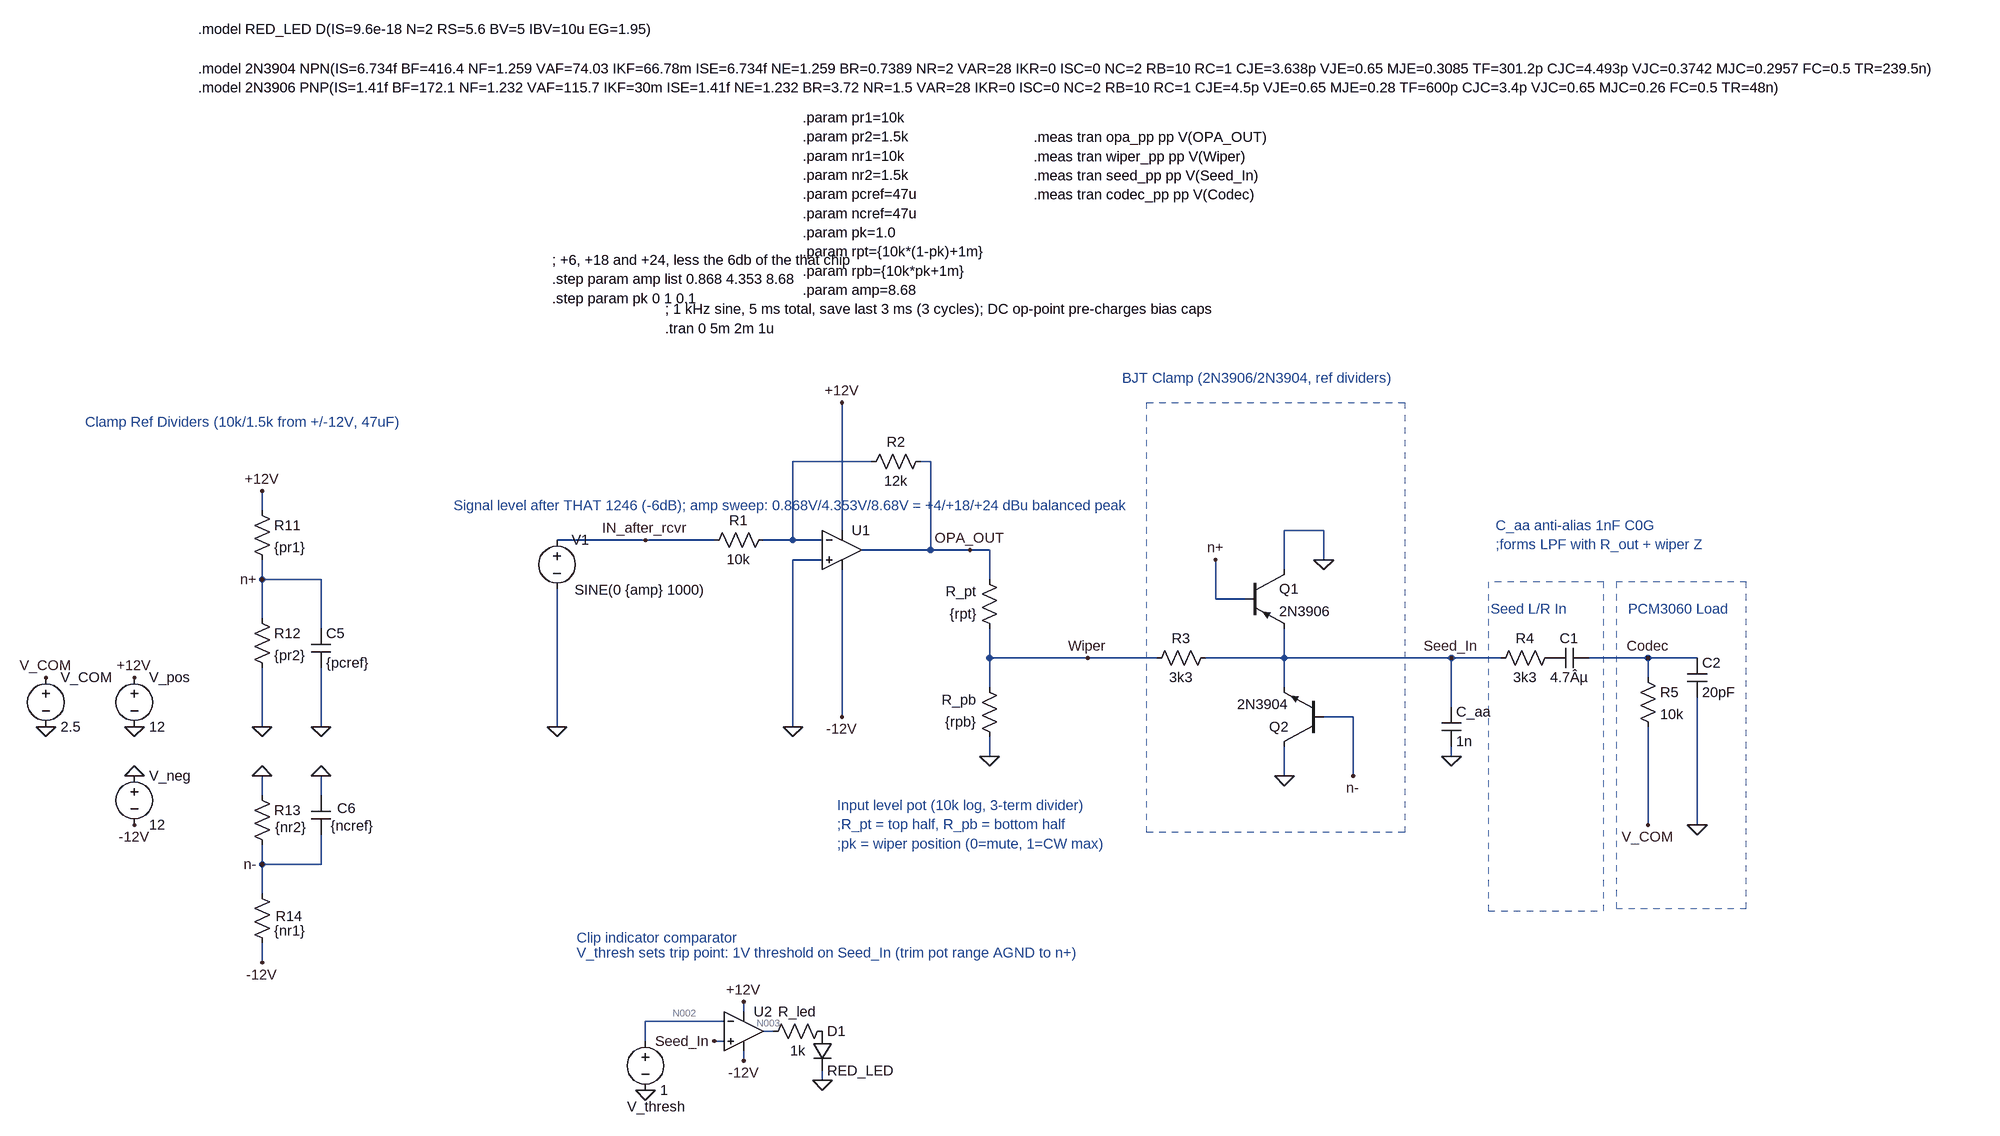
[diagram p0: schematic measure.asc]
measure.asc, the LTspice schematic file:
Version 4
SHEET 1 3124 2460
WIRE 608 576 480 576
WIRE 704 576 688 576
WIRE -384 656 -384 624
WIRE 560 688 560 480
WIRE 1344 688 1280 688
WIRE 240 704 96 704
WIRE 352 704 240 704
WIRE 480 704 480 576
WIRE 480 704 432 704
WIRE 528 704 480 704
WIRE 704 720 704 576
WIRE 704 720 592 720
WIRE 768 720 704 720
WIRE 800 720 768 720
WIRE 528 736 480 736
WIRE 1344 736 1344 688
WIRE 1280 752 1280 688
WIRE -384 768 -384 736
WIRE -288 768 -384 768
WIRE 800 768 800 720
WIRE 1168 800 1168 736
WIRE 1216 800 1168 800
WIRE -384 832 -384 768
WIRE -288 848 -288 768
WIRE 800 896 800 848
WIRE 960 896 800 896
WIRE 1072 896 960 896
WIRE 1280 896 1280 848
WIRE 1280 896 1152 896
WIRE 1552 896 1280 896
WIRE 1632 896 1552 896
WIRE 1872 896 1776 896
WIRE 1952 896 1872 896
WIRE 1872 928 1872 896
WIRE 800 944 800 896
WIRE 1280 944 1280 896
WIRE 1552 976 1552 896
WIRE 560 992 560 752
WIRE 1392 992 1344 992
WIRE -384 1008 -384 912
WIRE -288 1008 -288 912
WIRE 96 1008 96 784
WIRE 480 1008 480 736
WIRE 800 1056 800 1024
WIRE 1552 1056 1552 1040
WIRE 1280 1088 1280 1040
WIRE 1392 1088 1392 992
WIRE -384 1120 -384 1088
WIRE -288 1120 -288 1088
WIRE 1872 1168 1872 1008
WIRE 1952 1168 1952 960
WIRE -384 1232 -384 1200
WIRE -288 1232 -288 1184
WIRE -288 1232 -384 1232
WIRE -384 1280 -384 1232
WIRE -384 1392 -384 1360
WIRE 400 1472 400 1456
WIRE 368 1488 240 1488
WIRE 448 1504 432 1504
WIRE 240 1520 240 1488
WIRE 368 1520 352 1520
WIRE 400 1552 400 1536
WIRE 528 1584 528 1568
FLAG -592 928 +12V
FLAG -592 1008 0
FLAG -592 1088 0
FLAG -592 1168 -12V
FLAG -384 624 +12V
FLAG -384 768 n+
FLAG -384 1008 0
FLAG -288 1008 0
FLAG -384 1088 0
FLAG -384 1232 n-
FLAG -384 1392 -12V
FLAG -288 1088 0
FLAG -736 928 V_COM
FLAG -736 1008 0
FLAG 96 1008 0
FLAG 240 704 IN_after_rcvr
FLAG 480 1008 0
FLAG 560 480 +12V
FLAG 560 992 -12V
FLAG 1552 896 Seed_In
FLAG 1872 896 Codec
FLAG 1872 1168 V_COM
FLAG 1952 1168 0
FLAG 1168 736 n+
FLAG 1344 736 0
FLAG 1392 1088 n-
FLAG 1280 1088 0
FLAG 352 1520 Seed_In
FLAG 240 1600 0
FLAG 400 1456 +12V
FLAG 400 1552 -12V
FLAG 528 1584 0
FLAG 960 896 Wiper
FLAG 1552 1056 0
FLAG 800 1056 0
FLAG 768 720 OPA_OUT
SYMBOL voltage -592 912 R0
SYMATTR InstName V_pos
SYMATTR Value 12
SYMBOL voltage -592 1072 R0
SYMATTR InstName V_neg
SYMATTR Value 12
SYMBOL res -400 640 R0
SYMATTR InstName R11
SYMATTR Value {pr1}
SYMBOL res -400 816 R0
SYMATTR InstName R12
SYMATTR Value {pr2}
SYMBOL cap -304 848 R0
SYMATTR InstName C5
SYMATTR Value {pcref}
SYMBOL res -400 1104 R0
WINDOW 3 37 68 Left 2
SYMATTR Value {nr2}
SYMATTR InstName R13
SYMBOL res -400 1264 R0
WINDOW 0 38 53 Left 2
SYMATTR InstName R14
SYMATTR Value {nr1}
SYMBOL cap -304 1120 R0
WINDOW 0 42 21 Left 2
WINDOW 3 32 49 Left 2
SYMATTR InstName C6
SYMATTR Value {ncref}
SYMBOL voltage -736 912 R0
SYMATTR InstName V_COM
SYMATTR Value 2.5
SYMBOL voltage 96 688 R0
WINDOW 3 29 97 Left 2
SYMATTR Value SINE(0 {amp} 1000)
SYMATTR InstName V1
SYMATTR Value2 AC 1
SYMBOL res 336 720 R270
WINDOW 0 32 56 VTop 2
WINDOW 3 0 56 VBottom 2
SYMATTR InstName R1
SYMATTR Value 10k
SYMBOL OpAmps/UniversalOpAmp2 560 720 R0
SYMATTR InstName U1
SYMATTR Value2 Avol=1Meg GBW=53Meg Slew=24Meg Vhigh=11 Vlow=-11
SYMBOL res 592 592 R270
WINDOW 0 32 56 VTop 2
WINDOW 3 0 56 VBottom 2
SYMATTR InstName R2
SYMATTR Value 12k
SYMBOL res 1056 912 R270
WINDOW 0 32 56 VTop 2
WINDOW 3 0 56 VBottom 2
SYMATTR InstName R3
SYMATTR Value 3k3
SYMBOL pnp 1216 752 R0
SYMATTR InstName Q1
SYMATTR Value 2N3906
SYMBOL npn 1344 1040 R180
SYMATTR InstName Q2
SYMATTR Value 2N3904
SYMBOL res 1616 912 R270
WINDOW 0 32 56 VTop 2
WINDOW 3 0 56 VBottom 2
SYMATTR InstName R4
SYMATTR Value 3k3
SYMBOL cap 1776 880 R90
WINDOW 0 0 32 VBottom 2
WINDOW 3 32 32 VTop 2
SYMATTR InstName C1
SYMATTR Value 4.7Âµ
SYMBOL res 1856 912 R0
SYMATTR InstName R5
SYMATTR Value 10k
SYMBOL cap 1936 896 R0
SYMATTR InstName C2
SYMATTR Value 20pF
SYMBOL OpAmps/UniversalOpAmp2 400 1504 R0
SYMATTR InstName U2
SYMBOL voltage 240 1504 R0
WINDOW 0 -30 123 Left 2
SYMATTR InstName V_thresh
SYMATTR Value 1
SYMBOL res 432 1520 R270
WINDOW 0 32 56 VTop 2
WINDOW 3 0 56 VBottom 2
SYMATTR InstName R_led
SYMATTR Value 1k
SYMBOL diode 512 1504 R0
SYMATTR InstName D1
SYMATTR Value RED_LED
SYMBOL cap 1536 976 R0
SYMATTR InstName C_aa
SYMATTR Value 1n
SYMBOL Res 816 864 R180
WINDOW 0 36 76 Left 2
WINDOW 3 36 40 Left 2
SYMATTR InstName R_pt
SYMATTR Value {rpt}
SYMBOL Res 816 1040 R180
WINDOW 0 36 76 Left 2
WINDOW 3 36 40 Left 2
SYMATTR InstName R_pb
SYMATTR Value {rpb}
TEXT 272 328 Left 2 !; 1 kHz sine, 5 ms total, save last 3 ms (3 cycles); DC op-point pre-charges bias caps\n.tran 0 5m 2m 1u
TEXT -488 -64 Left 2 !.model 2N3904 NPN(IS=6.734f BF=416.4 NF=1.259 VAF=74.03 IKF=66.78m ISE=6.734f NE=1.259 BR=0.7389 NR=2 VAR=28 IKR=0 ISC=0 NC=2 RB=10 RC=1 CJE=3.638p VJE=0.65 MJE=0.3085 TF=301.2p CJC=4.493p VJC=0.3742 MJC=0.2957 FC=0.5 TR=239.5n)\n.model 2N3906 PNP(IS=1.41f BF=172.1 NF=1.232 VAF=115.7 IKF=30m ISE=1.41f NE=1.232 BR=3.72 NR=1.5 VAR=28 IKR=0 ISC=0 NC=2 RB=10 RC=1 CJE=4.5p VJE=0.65 MJE=0.28 TF=600p CJC=3.4p VJC=0.65 MJC=0.26 FC=0.5 TR=48n)
TEXT -488 -128 Left 2 !.model RED_LED D(IS=9.6e-18 N=2 RS=5.6 BV=5 IBV=10u EG=1.95)
TEXT -72 648 Left 2 ;Signal level after THAT 1246 (-6dB); amp sweep: 0.868V/4.353V/8.68V = +4/+18/+24 dBu balanced peak
TEXT 1016 440 Left 2 ;BJT Clamp (2N3906/2N3904, ref dividers)
TEXT 1616 816 Left 2 ;Seed L/R In
TEXT 1840 816 Left 2 ;PCM3060 Load
TEXT -672 512 Left 2 ;Clamp Ref Dividers (10k/1.5k from +/-12V, 47uF)
TEXT 496 16 Left 2 !.param pr1=10k\n.param pr2=1.5k\n.param nr1=10k\n.param nr2=1.5k\n.param pcref=47u\n.param ncref=47u\n.param pk=1.0\n.param rpt={10k*(1-pk)+1m}\n.param rpb={10k*pk+1m}\n.param amp=8.68
TEXT 872 48 Left 2 !.meas tran opa_pp pp V(OPA_OUT)\n.meas tran wiper_pp pp V(Wiper)\n.meas tran seed_pp pp V(Seed_In)\n.meas tran codec_pp pp V(Codec)
TEXT 128 1352 Left 2 ;Clip indicator comparator
TEXT 128 1376 Left 2 ;V_thresh sets trip point: 1V threshold on Seed_In (trim pot range AGND to n+)
TEXT 552 1136 Left 2 ;Input level pot (10k log, 3-term divider)\n;R_pt = top half, R_pb = bottom half\n;pk = wiper position (0=mute, 1=CW max)
TEXT 1624 680 Left 2 ;C_aa anti-alias 1nF C0G\n;forms LPF with R_out + wiper Z
TEXT 88 248 Left 2 !; +6, +18 and +24, less the 6db of the that chip\n.step param amp list 0.868 4.353 8.68\n.step param pk 0 1 0.1
RECTANGLE Normal 1820 1304 2032 772 2
RECTANGLE Normal 1612 1308 1800 772 2
RECTANGLE Normal 1476 1180 1056 480 2

The netlist it stands for:
* measure.asc
V_pos +12V 0 12
V_neg 0 -12V 12
R11 +12V n+ {pr1}
R12 n+ 0 {pr2}
C5 n+ 0 {pcref}
R13 0 n- {nr2}
R14 n- -12V {nr1}
C6 0 n- {ncref}
V_COM V_COM 0 2.5
V1 IN_after_rcvr 0 SINE(0 {amp} 1000) AC 1
R1 IN_after_rcvr N001 10k
XU1 0 N001 +12V -12V OPA_OUT level2 Avol=1Meg GBW=53Meg Slew=24Meg Vhigh=11 Vlow=-11 Ilimit=25m Rail=0 Vos=0 En=0 Enk=0 In=0 Ink=0 Rin=500Meg  ; pins In+ In- V+ V- OUT
R2 N001 OPA_OUT 12k
R3 Wiper Seed_In 3k3
Q1 0 n+ Seed_In 0 2N3906
Q2 0 n- Seed_In 0 2N3904
R4 Seed_In P001 3k3
C1 Codec P001 4.7Âµ
R5 Codec V_COM 10k
C2 Codec 0 20pF
XU2 Seed_In N002 +12V -12V N003 level2 Avol=1Meg GBW=10Meg Slew=10Meg Ilimit=25m Rail=0 Vos=0 En=0 Enk=0 In=0 Ink=0 Rin=500Meg  ; pins In+ In- V+ V- OUT
V_thresh N002 0 1
R_led N003 P002 1k
D1 P002 0 RED_LED
C_aa Seed_In 0 1n
R_pt Wiper OPA_OUT {rpt}
R_pb 0 Wiper {rpb}
.model D D
.lib standard.dio
.model NPN NPN
.model PNP PNP
.lib standard.bjt
; 1 kHz sine, 5 ms total, save last 3 ms (3 cycles); DC op-point pre-charges bias caps
.tran 0 5m 2m 1u
.model 2N3904 NPN(IS=6.734f BF=416.4 NF=1.259 VAF=74.03 IKF=66.78m ISE=6.734f NE=1.259 BR=0.7389 NR=2 VAR=28 IKR=0 ISC=0 NC=2 RB=10 RC=1 CJE=3.638p VJE=0.65 MJE=0.3085 TF=301.2p CJC=4.493p VJC=0.3742 MJC=0.2957 FC=0.5 TR=239.5n)
.model 2N3906 PNP(IS=1.41f BF=172.1 NF=1.232 VAF=115.7 IKF=30m ISE=1.41f NE=1.232 BR=3.72 NR=1.5 VAR=28 IKR=0 ISC=0 NC=2 RB=10 RC=1 CJE=4.5p VJE=0.65 MJE=0.28 TF=600p CJC=3.4p VJC=0.65 MJC=0.26 FC=0.5 TR=48n)
.model RED_LED D(IS=9.6e-18 N=2 RS=5.6 BV=5 IBV=10u EG=1.95)
* Signal level after THAT 1246 (-6dB); amp sweep: 0.868V/4.353V/8.68V = +4/+18/+24 dBu balanced peak
* BJT Clamp (2N3906/2N3904, ref dividers)
* Seed L/R In
* PCM3060 Load
* Clamp Ref Dividers (10k/1.5k from +/-12V, 47uF)
.param pr1=10k
.param pr2=1.5k
.param nr1=10k
.param nr2=1.5k
.param pcref=47u
.param ncref=47u
.param pk=1.0
.param rpt={10k*(1-pk)+1m}
.param rpb={10k*pk+1m}
.param amp=8.68
.meas tran opa_pp pp V(OPA_OUT)
.meas tran wiper_pp pp V(Wiper)
.meas tran seed_pp pp V(Seed_In)
.meas tran codec_pp pp V(Codec)
* Clip indicator comparator
* V_thresh sets trip point: 1V threshold on Seed_In (trim pot range AGND to n+)
* Input level pot (10k log, 3-term divider)
* ;R_pt = top half, R_pb = bottom half
* ;pk = wiper position (0=mute, 1=CW max)
* C_aa anti-alias 1nF C0G
* ;forms LPF with R_out + wiper Z
; +6, +18 and +24, less the 6db of the that chip
.step param amp list 0.868 4.353 8.68
.step param pk 0 1 0.1
.lib UniversalOpAmp2.lib
.backanno
.end

* Results of the author's LTspice run, read from the files saved beside the schematic
* Operating Point (first step), zero values left out:
*   amp = 868 m
*   V(+12v) = 12 V
*   V(-12v) = -12 V
*   V(n+) = 1.565 V
*   V(n-) = -1.565 V
*   V(v_com) = 2.5 V
*   V(seed_in) = 38.76 nV
*   V(p001) = 77.53 nV
*   V(codec) = 2.5 V
*   V(n003) = -11.93 V
*   V(n002) = 1 V
*   V(p002) = -5.206 V
*   Ic(Q1) = -1.566 pA
*   Ib(Q1) = 3.132 pA
*   Ie(Q1) = -1.567 pA
*   Ic(Q2) = 1.574 pA
*   Ib(Q2) = -3.146 pA
*   Ie(Q2) = 1.572 pA
*   I(C1) = 11.75 pA
*   I(D1) = -6.723 mA
*   I(R11) = 1.043 mA
*   I(R12) = 1.043 mA
*   I(R13) = 1.043 mA
*   I(R14) = 1.043 mA
*   I(R3) = -11.74 pA
*   I(R4) = -11.75 pA
*   I(R5) = -11.75 pA
*   I(R_led) = -6.723 mA
*   I(R_pb) = -11.74 pA
*   I(V_pos) = -2.245 mA
*   I(V_neg) = -8.968 mA
*   I(V_com) = -11.75 pA
*   I(V_thresh) = -2 nA
*   Ix(u1:3) = 1.199 mA
*   Ix(u1:4) = -1.199 mA
*   Ix(u2:2) = 2 nA
*   Ix(u2:3) = 2.684 µA
*   Ix(u2:4) = -6.725 mA
*   Ix(u2:5) = 6.723 mA
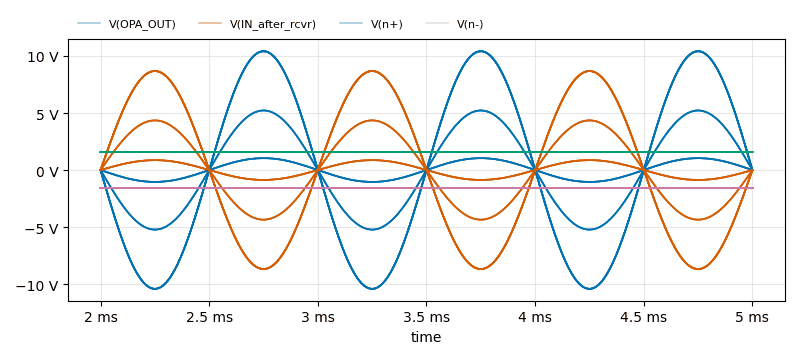
[diagram p1: Transient Analysis of measure.asc, plotted from the saved traces]
* Transient Analysis, 33 runs:
*   V(OPA_OUT) [run 1]: min -1.042 V, max 1.042 V, average 1.317 µV, rms 736.5 mV, last 43.39 µV
*   V(OPA_OUT) [run 2]: min -10.42 V, max 10.42 V, average 0 V, rms 7.365 V, last 433.9 µV
*   V(OPA_OUT) [run 3]: min -5.224 V, max 5.224 V, average -32.15 µV, rms 3.694 V, last 217.6 µV
*   V(OPA_OUT) [run 4]: min -1.042 V, max 1.042 V, average 7.227 µV, rms 736.6 mV, last 43.39 µV
*   V(OPA_OUT) [run 5]: min -10.42 V, max 10.42 V, average 572.9 µV, rms 7.37 V, last 433.9 µV
*   V(OPA_OUT) [run 6]: min -5.224 V, max 5.223 V, average 608.2 µV, rms 3.694 V, last 217.6 µV
*   V(OPA_OUT) [run 7]: min -1.042 V, max 1.042 V, average 34.13 µV, rms 736.6 mV, last 43.4 µV
*   V(OPA_OUT) [run 8]: min -10.42 V, max 10.42 V, average 229.1 µV, rms 7.37 V, last 434 µV
*   V(IN_after_rcvr) [run 1]: min -868 mV, max 868 mV, average -949.9 nV, rms 613.8 mV, last 0 V
*   V(IN_after_rcvr) [run 2]: min -8.68 V, max 8.68 V, average -4.273 µV, rms 6.138 V, last 0 V
*   V(IN_after_rcvr) [run 3]: min -4.353 V, max 4.353 V, average 26.79 µV, rms 3.079 V, last 0 V
*   V(IN_after_rcvr) [run 4]: min -868 mV, max 868 mV, average -6.025 µV, rms 613.9 mV, last 0 V
*   V(IN_after_rcvr) [run 5]: min -8.68 V, max 8.68 V, average -476.8 µV, rms 6.141 V, last 0 V
*   V(IN_after_rcvr) [run 6]: min -4.353 V, max 4.353 V, average -506.4 µV, rms 3.078 V, last 0 V
*   V(IN_after_rcvr) [run 7]: min -868 mV, max 868 mV, average -28.44 µV, rms 613.9 mV, last 0 V
*   V(IN_after_rcvr) [run 8]: min -8.68 V, max 8.679 V, average -190.6 µV, rms 6.142 V, last 0 V
*   V(n+) [run 1]: min 1.565 V, max 1.565 V, average 1.565 V, rms 1.565 V, last 1.565 V
*   V(n+) [run 2]: min 1.565 V, max 1.565 V, average 1.565 V, rms 1.565 V, last 1.565 V
*   V(n+) [run 3]: min 1.565 V, max 1.565 V, average 1.565 V, rms 1.565 V, last 1.565 V
*   V(n+) [run 4]: min 1.565 V, max 1.565 V, average 1.565 V, rms 1.565 V, last 1.565 V
*   V(n+) [run 5]: min 1.565 V, max 1.565 V, average 1.565 V, rms 1.565 V, last 1.565 V
*   V(n+) [run 6]: min 1.565 V, max 1.565 V, average 1.565 V, rms 1.565 V, last 1.565 V
*   V(n+) [run 7]: min 1.565 V, max 1.565 V, average 1.565 V, rms 1.565 V, last 1.565 V
*   V(n+) [run 8]: min 1.566 V, max 1.566 V, average 1.566 V, rms 1.566 V, last 1.566 V
*   V(n-) [run 1]: min -1.565 V, max -1.565 V, average -1.565 V, rms 1.565 V, last -1.565 V
*   V(n-) [run 2]: min -1.565 V, max -1.565 V, average -1.565 V, rms 1.565 V, last -1.565 V
*   V(n-) [run 3]: min -1.565 V, max -1.565 V, average -1.565 V, rms 1.565 V, last -1.565 V
*   V(n-) [run 4]: min -1.565 V, max -1.565 V, average -1.565 V, rms 1.565 V, last -1.565 V
*   V(n-) [run 5]: min -1.565 V, max -1.565 V, average -1.565 V, rms 1.565 V, last -1.565 V
*   V(n-) [run 6]: min -1.565 V, max -1.565 V, average -1.565 V, rms 1.565 V, last -1.565 V
*   V(n-) [run 7]: min -1.565 V, max -1.565 V, average -1.565 V, rms 1.565 V, last -1.565 V
*   V(n-) [run 8]: min -1.566 V, max -1.566 V, average -1.566 V, rms 1.566 V, last -1.566 V
* From the log:
*   Measurement: opa_pp
*     step  PP(v(opa_out))  FROM  TO
*        1  2.08318  0  0.003
*        2  10.4471  0  0.003
*        3  20.8319  0  0.003
*        4  2.08312  0  0.003
*        5  10.447  0  0.003
*        6  20.8312  0  0.003
*        7  2.08308  0  0.003
*        8  10.4425  0  0.003
*        9  20.8314  0  0.003
*       10  2.08316  0  0.003
*       11  10.4468  0  0.003
*       12  20.8317  0  0.003
*       13  2.08316  0  0.003
*       14  10.4456  0  0.003
*       15  20.8308  0  0.003
*       16  2.08308  0  0.003
*       17  10.4456  0  0.003
*       18  20.8317  0  0.003
*       19  2.08312  0  0.003
*       20  10.4471  0  0.003
*       21  20.8316  0  0.003
*       22  2.08304  0  0.003
*       23  10.4465  0  0.003
*       24  20.8305  0  0.003
*       25  2.08316  0  0.003
*       26  10.4453  0  0.003
*       27  20.8312  0  0.003
*       28  2.08312  0  0.003
*       29  10.446  0  0.003
*       30  20.8315  0  0.003
*       31  2.08304  0  0.003
*       32  10.447  0  0.003
*       33  20.8299  0  0.003
*   Measurement: wiper_pp
*     step  PP(v(wiper))  FROM  TO
*        1  2.08316e-07  0  0.003
*        2  1.0447e-06  0  0.003
*        3  2.08319e-06  0  0.003
*        4  0.197581  0  0.003
*        5  0.990906  0  0.003
*        6  1.97581  0  0.003
*        7  0.379952  0  0.003
*        8  1.90492  0  0.003
*        9  3.79962  0  0.003
*       10  0.554678  0  0.003
*       11  2.7817  0  0.003
*       12  5.5375  0  0.003
*       13  0.727876  0  0.003
*       14  3.65007  0  0.003
*       15  6.79127  0  0.003
*       16  0.905079  0  0.003
*       17  4.53829  0  0.003
*       18  7.96351  0  0.003
*       19  1.09182  0  0.003
*       20  5.47013  0  0.003
*       21  9.24167  0  0.003
*       22  1.29422  0  0.003
*       23  6.26829  0  0.003
*       24  10.7757  0  0.003
*       25  1.51984  0  0.003
*       26  7.16003  0  0.003
*       27  12.7995  0  0.003
*       28  1.77828  0  0.003
*       29  8.40247  0  0.003
*       30  15.7741  0  0.003
*       31  2.08304  0  0.003
*       32  10.447  0  0.003
*       33  20.8299  0  0.003
*   Measurement: seed_pp
*     step  PP(v(seed_in))  FROM  TO
*        1  3.05356e-05  0  0.003
*        2  2.891e-05  0  0.003
*        3  3.57e-05  0  0.003
*        4  0.158285  0  0.003
*        5  0.793773  0  0.003
*        6  1.58283  0  0.003
*        7  0.304377  0  0.003
*        8  1.52635  0  0.003
*        9  3.04378  0  0.003
*       10  0.444345  0  0.003
*       11  2.22827  0  0.003
*       12  4.41904  0  0.003
*       13  0.583093  0  0.003
*       14  2.9242  0  0.003
*       15  4.67236  0  0.003
*       16  0.72503  0  0.003
*       17  3.63607  0  0.003
*       18  4.72696  0  0.003
*       19  0.874574  0  0.003
*       20  4.3735  0  0.003
*       21  4.76355  0  0.003
*       22  1.03681  0  0.003
*       23  4.62742  0  0.003
*       24  4.7958  0  0.003
*       25  1.21753  0  0.003
*       26  4.69345  0  0.003
*       27  4.82914  0  0.003
*       28  1.42458  0  0.003
*       29  4.74058  0  0.003
*       30  4.86878  0  0.003
*       31  1.66875  0  0.003
*       32  4.78821  0  0.003
*       33  4.92397  0  0.003
*   Measurement: codec_pp
*     step  PP(v(codec))  FROM  TO
*        1  0.000291824  0  0.003
*        2  0.000166655  0  0.003
*        3  0.000246525  0  0.003
*        4  0.119013  0  0.003
*        5  0.596833  0  0.003
*        6  1.19011  0  0.003
*        7  0.228853  0  0.003
*        8  1.14762  0  0.003
*        9  2.28856  0  0.003
*       10  0.334092  0  0.003
*       11  1.6754  0  0.003
*       12  3.32259  0  0.003
*       13  0.438413  0  0.003
*       14  2.19865  0  0.003
*       15  3.51306  0  0.003
*       16  0.545141  0  0.003
*       17  2.7339  0  0.003
*       18  3.55411  0  0.003
*       19  0.657581  0  0.003
*       20  3.28836  0  0.003
*       21  3.58163  0  0.003
*       22  0.779562  0  0.003
*       23  3.47927  0  0.003
*       24  3.60587  0  0.003
*       25  0.915437  0  0.003
*       26  3.52892  0  0.003
*       27  3.63095  0  0.003
*       28  1.07111  0  0.003
*       29  3.56435  0  0.003
*       30  3.66074  0  0.003
*       31  1.2547  0  0.003
*       32  3.60016  0  0.003
*       33  3.70224  0  0.003